# EAGLE schematic display72 (EAGLE 7.7.0)

## Sheet 1 of 5: Powersupply
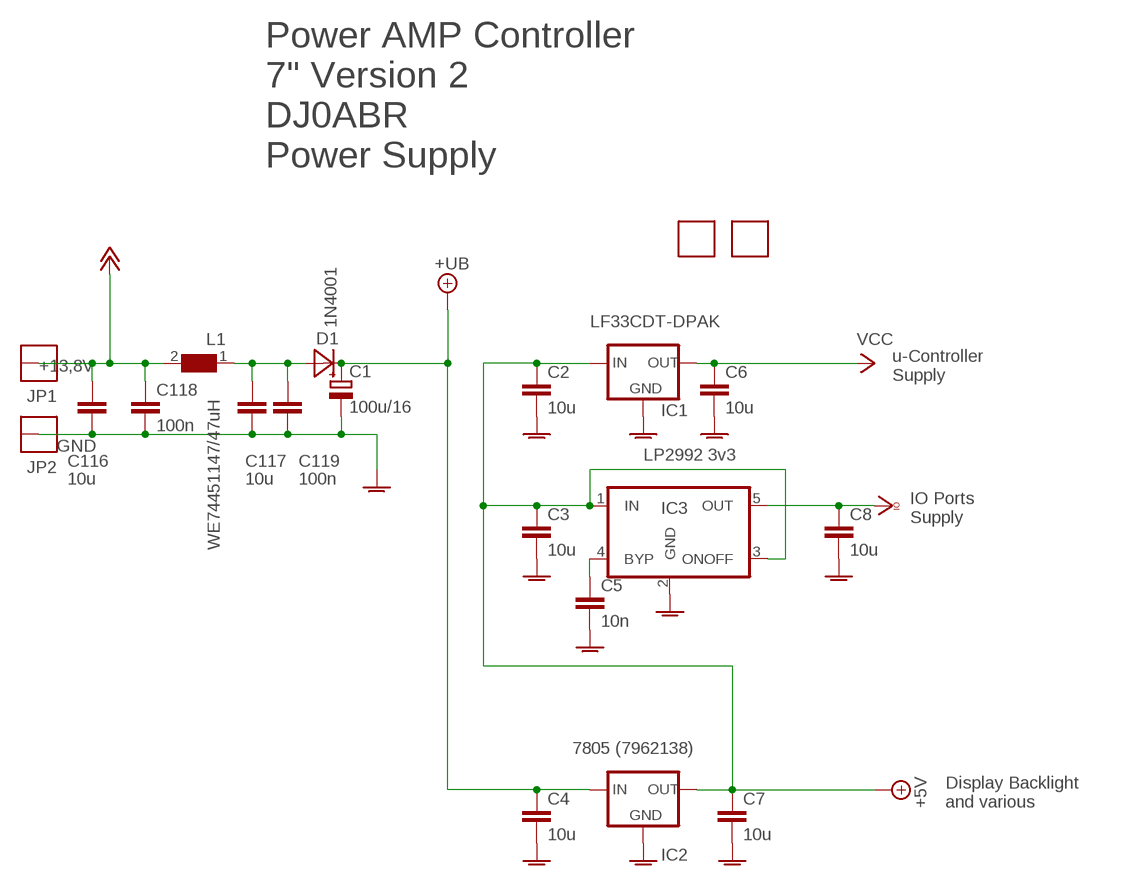
[diagram p0: schematic, sheet 1]

### Parts
C1  100u/16  CPOL-EUE2.5-7  [E2,5-7]
C2  10u  C-EUC0805  [C0805]
C3  10u  C-EUC0805  [C0805]
C4  10u  C-EUC0805  [C0805]
C5  10n  C-EUC0603  [C0603]
C6  10u  C-EUC0603  [C0603]
C7  10u  C-EUC0603  [C0603]
C8  10u  C-EUC0603  [C0603]
C116  10u  C-EUC0805  [C0805]
C117  10u  C-EUC0805  [C0805]
C118  100n  C-EUC0603  [C0603]
C119  100n  C-EUC0603  [C0603]
D1  1N4001  DIODE_GROSSSMD  [MELF]
FID1  FIDUCIAL  [FIDUCIAL]
FID2  FIDUCIAL  [FIDUCIAL]
IC1  LF33CDT-DPAK  LP2950CDT-5.0  [DPACK]
IC2  7805 (7962138)  78XXSWITCHREG  [78SR_SWITCHREG]
IC3  LP2992 3v3  UREG5  [SOT23-5]
JP1  THICKPINSQUARE  [THICKPIN]
JP2  THICKPINSQUARE  [THICKPIN]
L1  WE74451147/47uH  WE-PD3-74451147_S  [S]

### Nets
+5V: C2.1 C3.1 C7.1 IC1.1(IN) IC2.3(OUT) IC3.1(IN) IC3.3(ONOFF) ; also sheet 3,4
+UB [Supply]: C1.+ C4.1 D1.1(C) IC2.1(IN)
AGND [AGND]: C1.- C2.2 C3.2 C4.2 C5.2 C6.2 C7.2 C8.2 C116.2 C117.2 C118.2 C119.2 IC1.4(GND) IC2.2(GND) IC3.2(GND) JP2.1 ; supply symbol labelled  ; also sheet 2,3,4,5
N$47 [Supply]: C117.1 C119.1 D1.2(A) L1.1
N$125: C5.1 IC3.4(BYP)
PLUSZWOELF [Supply]: C116.1 C118.1 JP1.1 L1.2 ; supply symbol labelled +12V ; also sheet 2
VCC [Supply]: C6.1 IC1.3(OUT) ; also sheet 2,4,5
VCCIO [Supply]: C8.1 IC3.5(OUT) ; supply symbol labelled  ; also sheet 3,4
Unconnected: FID1.P$1 FID2.P$1

### Notes on the sheet
- Power AMP Controller
  7" Version 2
  DJ0ABR
  Power Supply
- +13,8V
- u-Controller 
  Supply
- GND
- IO Ports
  Supply
- Display Backlight
  and various

## Sheet 2 of 5: IO Ports LED,PTT,Switch
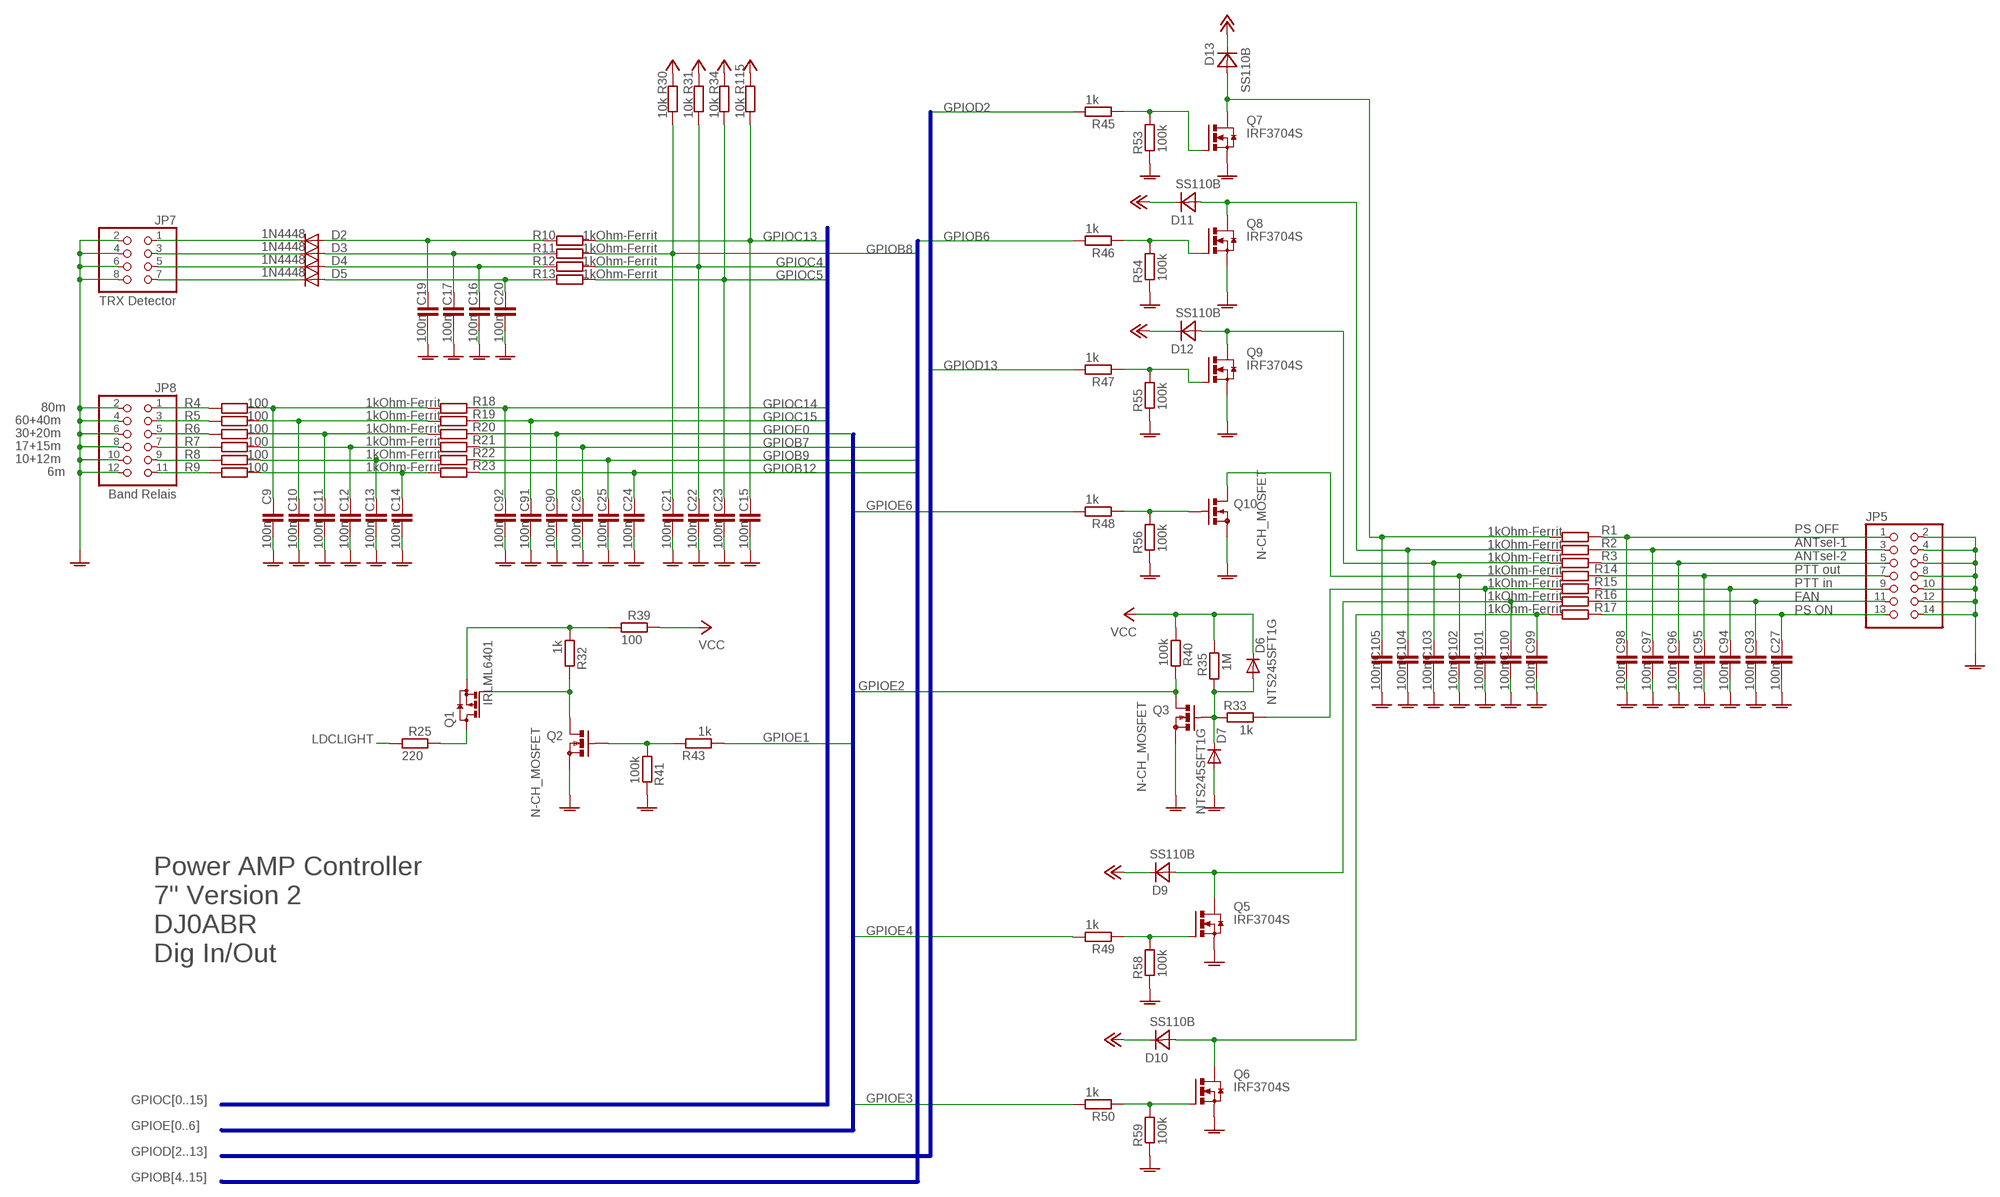
[diagram p1: schematic, sheet 2]

### Parts
C9  100n  C-EUC0603  [C0603]
C10  100n  C-EUC0603  [C0603]
C11  100n  C-EUC0603  [C0603]
C12  100n  C-EUC0603  [C0603]
C13  100n  C-EUC0603  [C0603]
C14  100n  C-EUC0603  [C0603]
C15  100n  C-EUC0603  [C0603]
C16  100n  C-EUC0603  [C0603]
C17  100n  C-EUC0603  [C0603]
C19  100n  C-EUC0603  [C0603]
C20  100n  C-EUC0603  [C0603]
C21  100n  C-EUC0603  [C0603]
C22  100n  C-EUC0603  [C0603]
C23  100n  C-EUC0603  [C0603]
C24  100n  C-EUC0603  [C0603]
C25  100n  C-EUC0603  [C0603]
C26  100n  C-EUC0603  [C0603]
C27  100n  C-EUC0603  [C0603]
C90  100n  C-EUC0603  [C0603]
C91  100n  C-EUC0603  [C0603]
C92  100n  C-EUC0603  [C0603]
C93  100n  C-EUC0603  [C0603]
C94  100n  C-EUC0603  [C0603]
C95  100n  C-EUC0603  [C0603]
C96  100n  C-EUC0603  [C0603]
C97  100n  C-EUC0603  [C0603]
C98  100n  C-EUC0603  [C0603]
C99  100n  C-EUC0603  [C0603]
C100  100n  C-EUC0603  [C0603]
C101  100n  C-EUC0603  [C0603]
C102  100n  C-EUC0603  [C0603]
C103  100n  C-EUC0603  [C0603]
C104  100n  C-EUC0603  [C0603]
C105  100n  C-EUC0603  [C0603]
D2  1N4448  DIODE-SOD523  [SOD523]
D3  1N4448  DIODE-SOD523  [SOD523]
D4  1N4448  DIODE-SOD523  [SOD523]
D5  1N4448  DIODE-SOD523  [SOD523]
D6  NTS245SFT1G  DIODE-MINIMELF  [MINIMELF]
D7  NTS245SFT1G  DIODE-MINIMELF  [MINIMELF]
D9  SS110B  DIODE_GROSSSMD  [MELF]
D10  SS110B  DIODE_GROSSSMD  [MELF]
D11  SS110B  DIODE_GROSSSMD  [MELF]
D12  SS110B  DIODE_GROSSSMD  [MELF]
D13  SS110B  DIODE_GROSSSMD  [MELF]
JP5  PINHD-2X7/90  [2X07/90]
JP7  TRX Detector  PINHD-2X4/90  [2X04/90]
JP8  Band Relais  PINHD-2X6/90  [2X06/90]
Q1  IRLML6401  BSS84  [SOT23]
Q2  N-CH_MOSFET  BS170_SMD  [SOT23]
Q3  N-CH_MOSFET  BS170_SMD  [SOT23]
Q5  IRF3704S  [D2PACK]
Q6  IRF3704S  [D2PACK]
Q7  IRF3704S  [D2PACK]
Q8  IRF3704S  [D2PACK]
Q9  IRF3704S  [D2PACK]
Q10  N-CH_MOSFET  BS170_SMD  [SOT23]
R1  1kOhm-Ferrit  R-EU_R0603  [R0603]
R2  1kOhm-Ferrit  R-EU_R0603  [R0603]
R3  1kOhm-Ferrit  R-EU_R0603  [R0603]
R4  100  R-EU_R0603  [R0603]
R5  100  R-EU_R0603  [R0603]
R6  100  R-EU_R0603  [R0603]
R7  100  R-EU_R0603  [R0603]
R8  100  R-EU_R0603  [R0603]
R9  100  R-EU_R0603  [R0603]
R10  1kOhm-Ferrit  R-EU_R0603  [R0603]
R11  1kOhm-Ferrit  R-EU_R0603  [R0603]
R12  1kOhm-Ferrit  R-EU_R0603  [R0603]
R13  1kOhm-Ferrit  R-EU_R0603  [R0603]
R14  1kOhm-Ferrit  R-EU_R0603  [R0603]
R15  1kOhm-Ferrit  R-EU_R0603  [R0603]
R16  1kOhm-Ferrit  R-EU_R0603  [R0603]
R17  1kOhm-Ferrit  R-EU_R0603  [R0603]
R18  1kOhm-Ferrit  R-EU_R0603  [R0603]
R19  1kOhm-Ferrit  R-EU_R0603  [R0603]
R20  1kOhm-Ferrit  R-EU_R0603  [R0603]
R21  1kOhm-Ferrit  R-EU_R0603  [R0603]
R22  1kOhm-Ferrit  R-EU_R0603  [R0603]
R23  1kOhm-Ferrit  R-EU_R0603  [R0603]
R25  220  R-EU_R0603  [R0603]
R30  10k  R-EU_R0603  [R0603]
R31  10k  R-EU_R0603  [R0603]
R32  1k  R-EU_R0603  [R0603]
R33  1k  R-EU_R0603  [R0603]
R34  10k  R-EU_R0603  [R0603]
R35  1M  R-EU_R0603  [R0603]
R39  100  R-EU_R0603  [R0603]
R40  100k  R-EU_R0603  [R0603]
R41  100k  R-EU_R0603  [R0603]
R43  1k  R-EU_R0603  [R0603]
R45  1k  R-EU_R0603  [R0603]
R46  1k  R-EU_R0603  [R0603]
R47  1k  R-EU_R0603  [R0603]
R48  1k  R-EU_R0603  [R0603]
R49  1k  R-EU_R0603  [R0603]
R50  1k  R-EU_R0603  [R0603]
R53  100k  R-EU_R0603  [R0603]
R54  100k  R-EU_R0603  [R0603]
R55  100k  R-EU_R0603  [R0603]
R56  100k  R-EU_R0603  [R0603]
R58  100k  R-EU_R0603  [R0603]
R59  100k  R-EU_R0603  [R0603]
R115  10k  R-EU_R0603  [R0603]

### Nets
AGND [AGND]: C9.2 C10.2 C11.2 C12.2 C13.2 C14.2 C15.2 C16.2 C17.2 C19.2 C20.2 C21.2 C22.2 C23.2 C24.2 C25.2 C26.2 C27.2 C90.2 C91.2 C92.2 C93.2 C94.2 C95.2 C96.2 C97.2 C98.2 C99.2 C100.2 C101.2 C102.2 C103.2 C104.2 C105.2 D7.A JP5.2 JP5.4 JP5.6 JP5.8 JP5.10 JP5.12 JP5.14 JP7.2 JP7.4 JP7.6 JP7.8 JP8.2 JP8.4 JP8.6 JP8.8 JP8.10 JP8.12 Q2.2(S) Q3.2(S) Q5.3(S) Q6.3(S) Q7.3(S) Q8.3(S) Q9.3(S) Q10.2(S) R41.2 R53.2 R54.2 R55.2 R56.2 R58.2 R59.2 ; supply symbol labelled  ; also sheet 1,3,4,5
GPIOB6: R46.1 ; also sheet 4
GPIOB7: C26.1 R21.1 ; also sheet 4
GPIOB8: C21.1 R11.2 R30.1 ; also sheet 4
GPIOB9: C25.1 R22.1 ; also sheet 4
GPIOB12: C24.1 R23.1 ; also sheet 4
GPIOC4: C22.1 R12.2 R31.1 ; also sheet 4
GPIOC5: C23.1 R13.2 R34.1 ; also sheet 4
GPIOC13: C15.1 R10.2 R115.1 ; also sheet 4
GPIOC14: C92.1 R18.1 ; also sheet 4
GPIOC15: C91.1 R19.1 ; also sheet 4
GPIOD2: R45.1 ; also sheet 4
GPIOD13: R47.1 ; also sheet 4
GPIOE0: C90.1 R20.1 ; also sheet 4
GPIOE1: R43.1 ; also sheet 4
GPIOE2: Q3.3(D) R40.1 ; also sheet 4
GPIOE3: R50.1 ; also sheet 4
GPIOE4: R49.1 ; also sheet 4
GPIOE6: R48.1 ; also sheet 4
LDCLIGHT: R25.1 ; also sheet 4
N$1: Q10.1(G) R48.2 R56.1
N$2: C102.1 Q10.3(D) R14.2
N$4: D6.A D7.C Q3.1(G) R33.2 R35.2
N$6: Q2.1(G) R41.1 R43.2
N$8: Q1.1(G) Q2.3(D) R32.2
N$10: Q1.3(D) R25.2
N$12: JP8.1 R4.1
N$33: C98.1 JP5.1 R1.1
N$45: Q9.1(G) R47.2 R55.1
N$46: C103.1 D12.2(A) Q9.2(D) R3.2
N$50: C97.1 JP5.3 R2.1
N$51: C96.1 JP5.5 R3.1
N$52: C95.1 JP5.7 R14.1
N$56: C94.1 JP5.9 R15.1
N$57: C93.1 JP5.11 R16.1
N$58: D3.C JP7.3
N$59: D4.C JP7.5
N$60: D5.C JP7.7
N$63: C27.1 JP5.13 R17.1
N$90: C9.1 R4.2 R18.2
N$94: C14.1 R9.2 R23.2
N$95: C13.1 R8.2 R22.2
N$98: C12.1 R7.2 R21.2
N$99: C11.1 R6.2 R20.2
N$100: C10.1 R5.2 R19.2
N$105: Q1.2(S) R32.1 R39.1
N$106: D2.C JP7.1
N$109: Q8.1(G) R46.2 R54.1
N$110: C104.1 D11.2(A) Q8.2(D) R2.2
N$115: JP8.3 R5.1
N$116: JP8.5 R6.1
N$118: Q7.1(G) R45.2 R53.1
N$119: JP8.7 R7.1
N$120: JP8.9 R8.1
N$121: JP8.11 R9.1
N$122: C105.1 D13.2(A) Q7.2(D) R1.2
N$126: C19.1 D2.A R10.1
N$127: C17.1 D3.A R11.1
N$128: C16.1 D4.A R12.1
N$129: C20.1 D5.A R13.1
N$132: C100.1 D9.2(A) Q5.2(D) R16.2
N$134: Q5.1(G) R49.2 R58.1
N$135: C99.1 D10.2(A) Q6.2(D) R17.2
N$136: Q6.1(G) R50.2 R59.1
PLUSZWOELF [Supply]: D9.1(C) D10.1(C) D11.1(C) D12.1(C) D13.1(C) ; supply symbol labelled +12V ; also sheet 1
PTT: C101.1 R15.2 R33.1
VCC [Supply]: D6.C R30.2 R31.2 R34.2 R35.1 R39.2 R40.2 R115.2 ; also sheet 1,4,5

### Buses
GPIOC[0..15]
GPIOE[0..6]
GPIOD[2..13]
GPIOB[4..15]

### Notes on the sheet
- 80m
- 60+40m
- 30+20m
- 17+15m
- 10+12m
- 6m
- PS OFF
  ANTsel-1
  ANTsel-2
  PTT out
  PTT in
  FAN
  PS ON
- Power AMP Controller
  7" Version 2
  DJ0ABR
  Dig In/Out

## Sheet 3 of 5: ANALOG
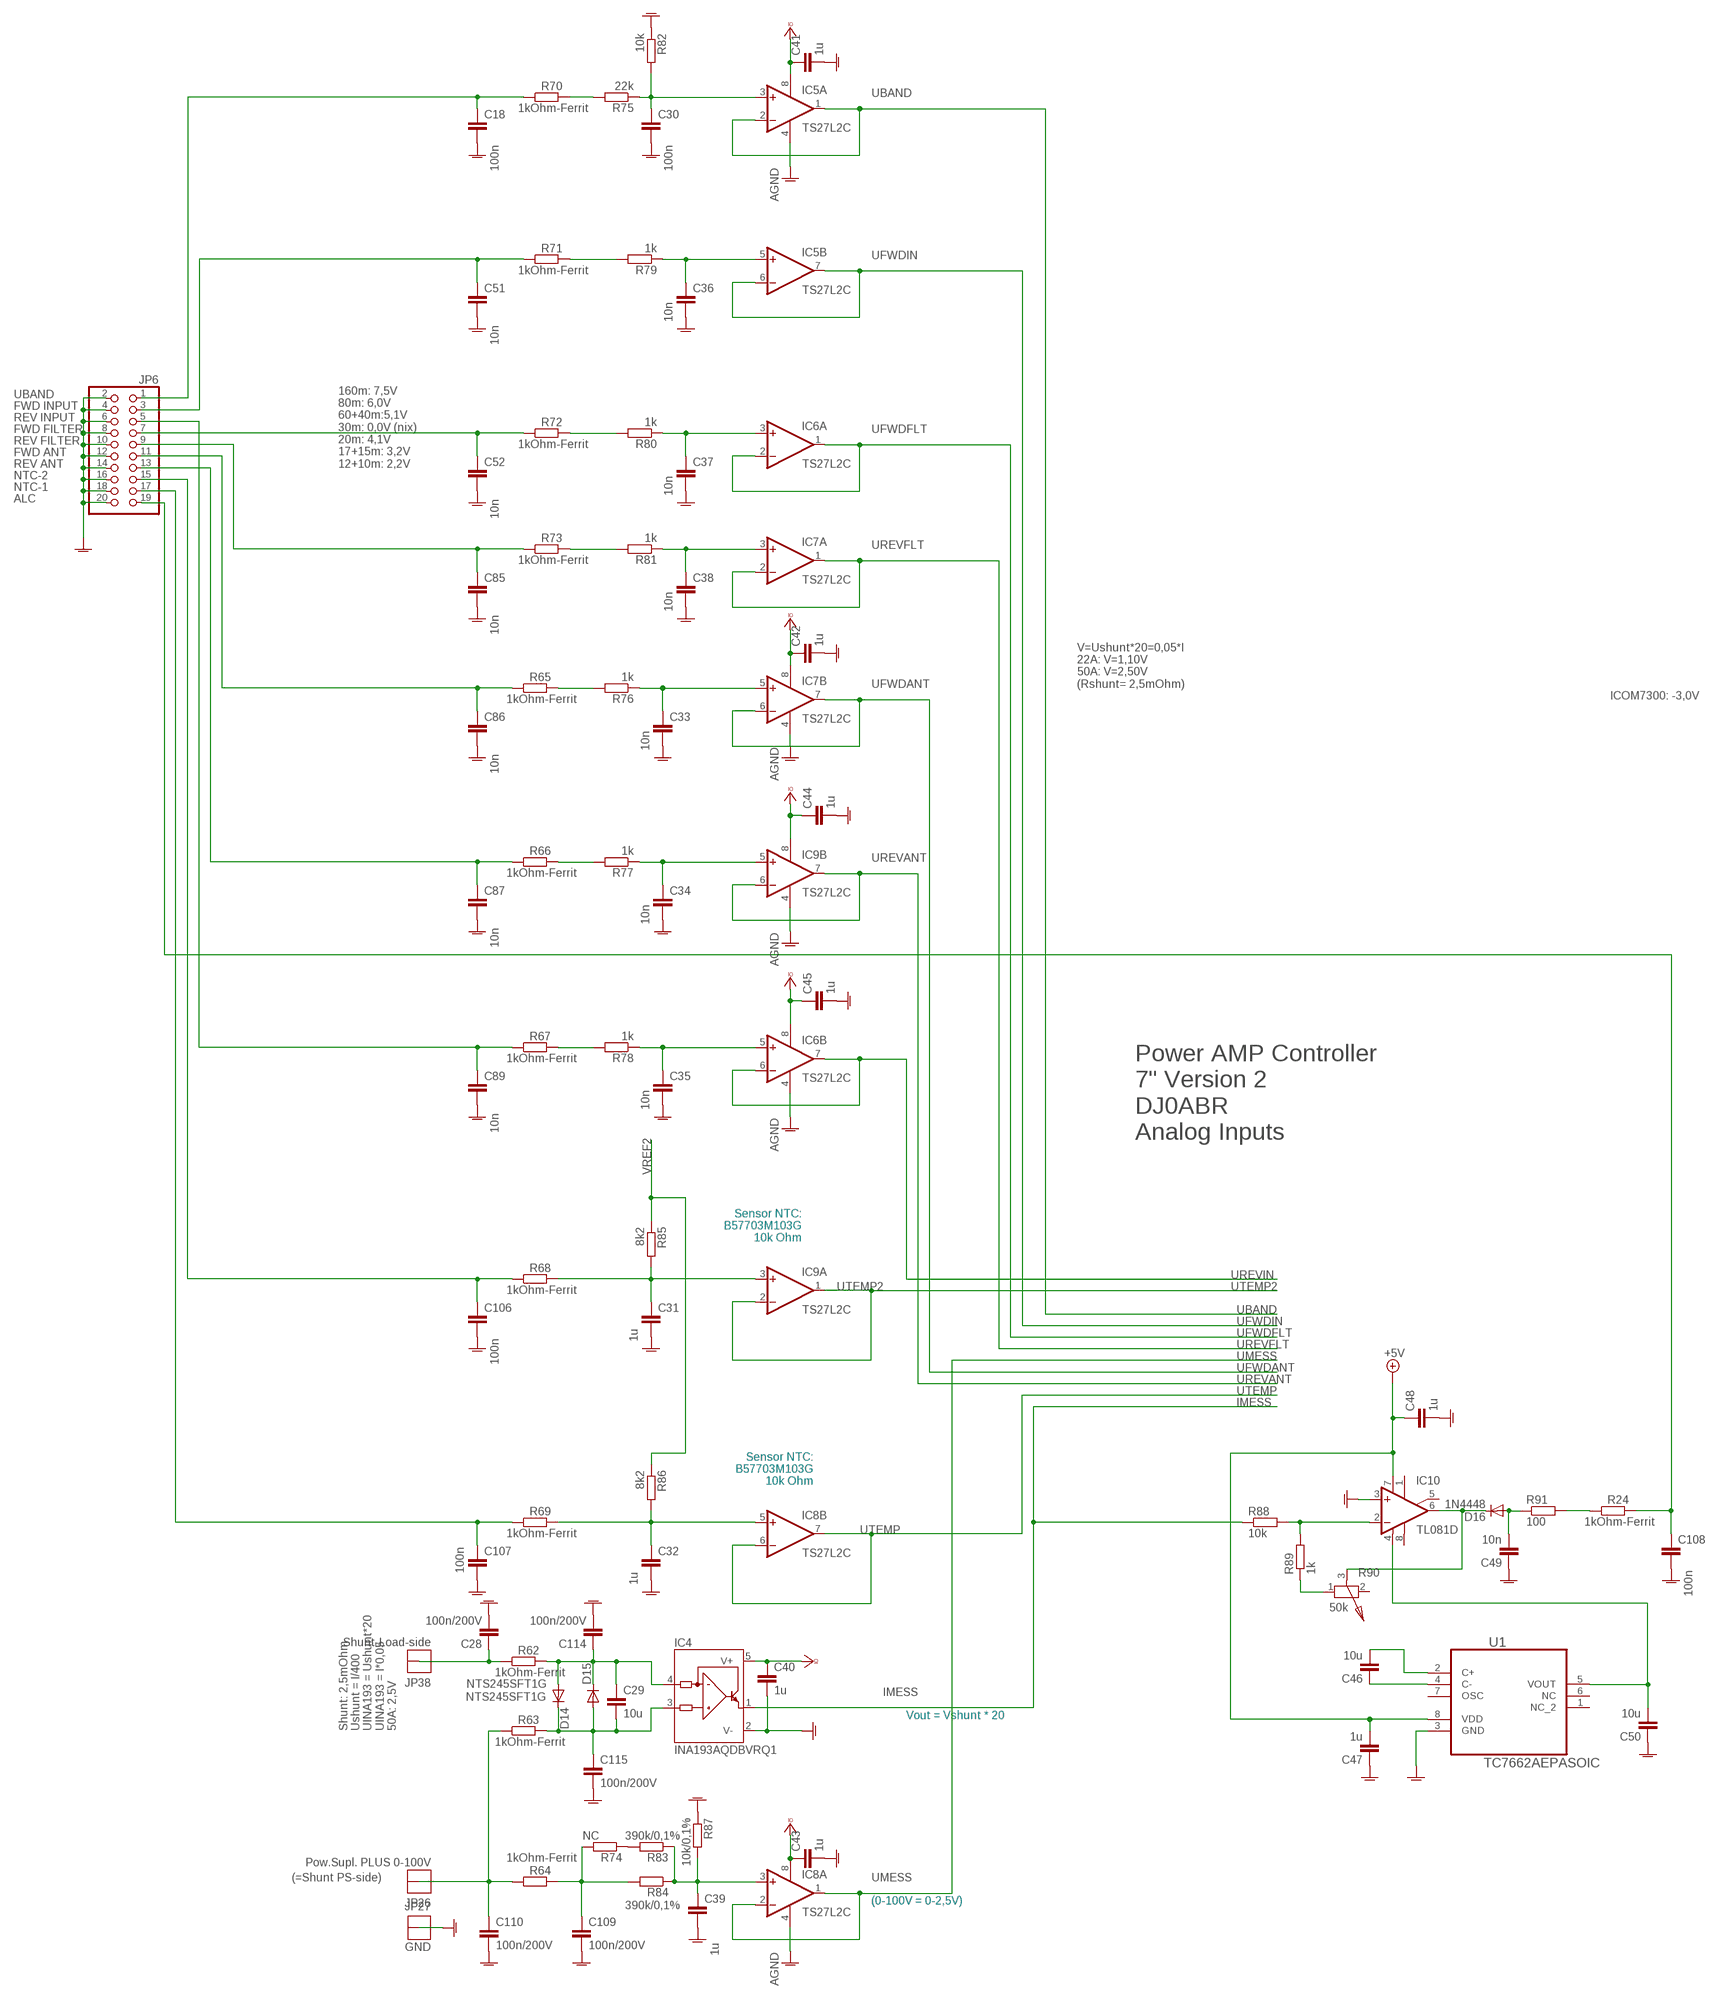
[diagram p2: schematic, sheet 3]

### Parts
C18  100n  C-EUC0603  [C0603]
C28  100n/200V  C-EUC1206K  [C1206K]
C29  10u  C-EUC0805  [C0805]
C30  100n  C-EUC0603  [C0603]
C31  1u  C-EUC0603  [C0603]
C32  1u  C-EUC0603  [C0603]
C33  10n  C-EUC0603  [C0603]
C34  10n  C-EUC0603  [C0603]
C35  10n  C-EUC0603  [C0603]
C36  10n  C-EUC0603  [C0603]
C37  10n  C-EUC0603  [C0603]
C38  10n  C-EUC0603  [C0603]
C39  1u  C-EUC0603  [C0603]
C40  1u  C-EUC0603  [C0603]
C41  1u  C-EUC0603  [C0603]
C42  1u  C-EUC0603  [C0603]
C43  1u  C-EUC0603  [C0603]
C44  1u  C-EUC0603  [C0603]
C45  1u  C-EUC0603  [C0603]
C46  10u  C-EUC0603  [C0603]
C47  1u  C-EUC0603  [C0603]
C48  1u  C-EUC0603  [C0603]
C49  10n  C-EUC0603  [C0603]
C50  10u  C-EUC0603  [C0603]
C51  10n  C-EUC0603  [C0603]
C52  10n  C-EUC0603  [C0603]
C85  10n  C-EUC0603  [C0603]
C86  10n  C-EUC0603  [C0603]
C87  10n  C-EUC0603  [C0603]
C89  10n  C-EUC0603  [C0603]
C106  100n  C-EUC0603  [C0603]
C107  100n  C-EUC0603  [C0603]
C108  100n  C-EUC0603  [C0603]
C109  100n/200V  C-EUC1206K  [C1206K]
C110  100n/200V  C-EUC1206K  [C1206K]
C114  100n/200V  C-EUC1206K  [C1206K]
C115  100n/200V  C-EUC1206K  [C1206K]
D14  NTS245SFT1G  DIODE-MINIMELF  [MINIMELF]
D15  NTS245SFT1G  DIODE-MINIMELF  [MINIMELF]
D16  1N4448  DIODE-SOD523  [SOD523]
IC4  INA193AQDBVRQ1  INA168  [SOT23-5]
IC5  TS27L2C  LM358D  [SO08]
IC6  TS27L2C  LM358D  [SO08]
IC7  TS27L2C  LM358D  [SO08]
IC8  TS27L2C  LM358D  [SO08]
IC9  TS27L2C  LM358D  [SO08]
IC10  TL081D  [SO08]
JP6  PINHD-2X10/90  [2X10/90]
JP26  Pow.Supl. PLUS 0-100V  THICKPINSQUARE  [THICKPIN]
JP27  GND  THICKPINSQUARE  [THICKPIN]
JP38  Shunt-Load-side  THICKPINSQUARE  [THICKPIN]
R24  1kOhm-Ferrit  R-EU_R0603  [R0603]
R62  1kOhm-Ferrit  R-EU_R0603  [R0603]
R63  1kOhm-Ferrit  R-EU_R0603  [R0603]
R64  1kOhm-Ferrit  R-EU_R0603  [R0603]
R65  1kOhm-Ferrit  R-EU_R0603  [R0603]
R66  1kOhm-Ferrit  R-EU_R0603  [R0603]
R67  1kOhm-Ferrit  R-EU_R0603  [R0603]
R68  1kOhm-Ferrit  R-EU_R0603  [R0603]
R69  1kOhm-Ferrit  R-EU_R0603  [R0603]
R70  1kOhm-Ferrit  R-EU_R0603  [R0603]
R71  1kOhm-Ferrit  R-EU_R0603  [R0603]
R72  1kOhm-Ferrit  R-EU_R0603  [R0603]
R73  1kOhm-Ferrit  R-EU_R0603  [R0603]
R74  NC  R-EU_R0603  [R0603]
R75  22k  R-EU_R0603  [R0603]
R76  1k  R-EU_R0603  [R0603]
R77  1k  R-EU_R0603  [R0603]
R78  1k  R-EU_R0603  [R0603]
R79  1k  R-EU_R0603  [R0603]
R80  1k  R-EU_R0603  [R0603]
R81  1k  R-EU_R0603  [R0603]
R82  10k  R-EU_R0603  [R0603]
R83  390k/0,1%  R-EU_R0603  [R0603]
R84  390k/0,1%  R-EU_R0603  [R0603]
R85  8k2  R-EU_R0603  [R0603]
R86  8k2  R-EU_R0603  [R0603]
R87  10k/0,1%  R-EU_R0603  [R0603]
R88  10k  R-EU_R0603  [R0603]
R89  1k  R-EU_R0603  [R0603]
R90  50k  MINIPOTI-S  [MINIPOTI]
R91  100  R-EU_R0603  [R0603]
U1  TC7662AEPASOIC  [SO-8]

### Nets
+5V: C47.2 C48.1 IC10.7(V+) U1.8(VDD) ; also sheet 1,4
AGND [AGND]: C18.2 C28.2 C30.2 C31.2 C32.2 C33.2 C34.2 C35.2 C36.2 C37.2 C38.2 C39.2 C40.2 C41.2 C42.2 C43.2 C44.2 C45.2 C47.1 C48.2 C49.1 C50.1 C51.2 C52.2 C85.2 C86.2 C87.2 C89.2 C106.2 C107.2 C108.2 C109.2 C110.2 C114.2 C115.2 IC4.2(V-) IC5.4(P:V-) IC6.4(P:V-) IC7.4(P:V-) IC8.4(P:V-) IC9.4(P:V-) IC10.3(+IN) JP6.2 JP6.4 JP6.6 JP6.8 JP6.10 JP6.12 JP6.14 JP6.16 JP6.18 JP6.20 JP27.1 R82.1 R87.1 U1.3(GND) ; supply symbol labelled  ; also sheet 1,2,4,5
IMESS: IC4.1(OUT) R88.1 ; also sheet 4
N$3: R24.1 R91.2
N$19: R70.2 R75.2
N$21: R71.2 R79.2
N$38: R72.2 R80.2
N$49: C30.1 IC5.3(A:+IN) R75.1 R82.2
N$53: C18.1 JP6.1 R70.1
N$54: R73.2 R81.2
N$55: C109.1 R64.2 R74.2 R84.2
N$61: R65.2 R76.2
N$62: R66.2 R77.2
N$64: C39.1 IC8.3(A:+IN) R83.1 R84.1 R87.2
N$72: C33.1 IC7.5(B:+IN) R76.1
N$73: C86.1 JP6.11 R65.1
N$75: C34.1 IC9.5(B:+IN) R77.1
N$76: C87.1 JP6.13 R66.1
N$78: C29.1 C114.1 D14.A D15.C IC4.4(IN-) R62.2
N$79: C29.2 C115.1 D14.C D15.A IC4.3(IN+) R63.2
N$80: C28.1 JP38.1 R62.1
N$81: C110.1 JP26.1 R63.1 R64.1
N$82: C32.1 IC8.5(B:+IN) R69.2 R86.2
N$83: C107.1 JP6.17 R69.1
N$85: C38.1 IC7.3(A:+IN) R81.1
N$86: C85.1 JP6.9 R73.1
N$88: C37.1 IC6.3(A:+IN) R80.1
N$89: C52.1 JP6.7 R72.1
N$91: C36.1 IC5.5(B:+IN) R79.1
N$92: C51.1 JP6.3 R71.1
N$108: C35.1 IC6.5(B:+IN) R78.1
N$111: C89.1 JP6.5 R67.1
N$112: R67.2 R78.2
N$113: C31.1 IC9.3(A:+IN) R68.2 R85.2
N$114: C106.1 JP6.15 R68.1
N$124: R74.1 R83.2
N$144: C46.1 U1.4(C-)
N$145: C46.2 U1.2(C+)
N$146: C50.2 IC10.4(V-) U1.5(VOUT)
N$147: D16.C IC10.6(OUT) R90.3
N$148: C108.1 JP6.19 R24.2
N$149: IC10.2(-IN) R88.2 R89.2
N$150: R89.1 R90.1
N$151: C49.2 D16.A R91.1
UBAND: IC5.1(A:OUT) IC5.2(A:-IN) ; also sheet 4
UFWDANT: IC7.6(B:-IN) IC7.7(B:OUT) ; also sheet 4
UFWDFLT: IC6.1(A:OUT) IC6.2(A:-IN) ; also sheet 4
UFWDIN: IC5.6(B:-IN) IC5.7(B:OUT) ; also sheet 4
UMESS: IC8.1(A:OUT) IC8.2(A:-IN) ; also sheet 4
UREVANT: IC9.6(B:-IN) IC9.7(B:OUT) ; also sheet 4
UREVFLT: IC7.1(A:OUT) IC7.2(A:-IN) ; also sheet 4
UREVIN: IC6.6(B:-IN) IC6.7(B:OUT) ; also sheet 4
UTEMP: IC8.6(B:-IN) IC8.7(B:OUT) ; also sheet 4
UTEMP2: IC9.1(A:OUT) IC9.2(A:-IN) ; also sheet 4
VCCIO [Supply]: C40.1 C41.1 C42.1 C43.1 C44.1 C45.1 IC4.5(V+) IC5.8(P:V+) IC6.8(P:V+) IC7.8(P:V+) IC8.8(P:V+) IC9.8(P:V+) ; supply symbol labelled  ; also sheet 1,4
VREF2: R85.1 R86.1 ; also sheet 4
Unconnected: IC10.1(ON1) IC10.5(ON2) IC10.8(OPT) R90.2 U1.1(NC_2) U1.6(NC) U1.7(OSC)

### Notes on the sheet
- UBAND
- FWD INPUT
- REV INPUT
- FWD FILTER
- REV FILTER
- FWD ANT
- REV ANT
- 160m: 7,5V
  80m: 6,0V
  60+40m:5,1V
  30m: 0,0V (nix)
  20m: 4,1V
  17+15m: 3,2V
  12+10m: 2,2V
- NTC-2
- NTC-1
- ALC
- V=Ushunt*20=0,05*I
  22A: V=1,10V
  50A: V=2,50V
  (Rshunt= 2,5mOhm)
- ICOM7300: -3,0V
- Power AMP Controller
  7" Version 2
  DJ0ABR
  Analog Inputs
- Sensor NTC:
  B57703M103G
  10k Ohm
- Sensor NTC:
  B57703M103G
  10k Ohm
- Vout = Vshunt * 20
- Shunt: 2,5mOhm
  Ushunt = I/400
  UINA193 = Ushunt*20
  UINA193 = I*0,05
  50A: 2,5V
- (=Shunt PS-side)
- (0-100V = 0-2,5V)

## Sheet 4 of 5: CPU
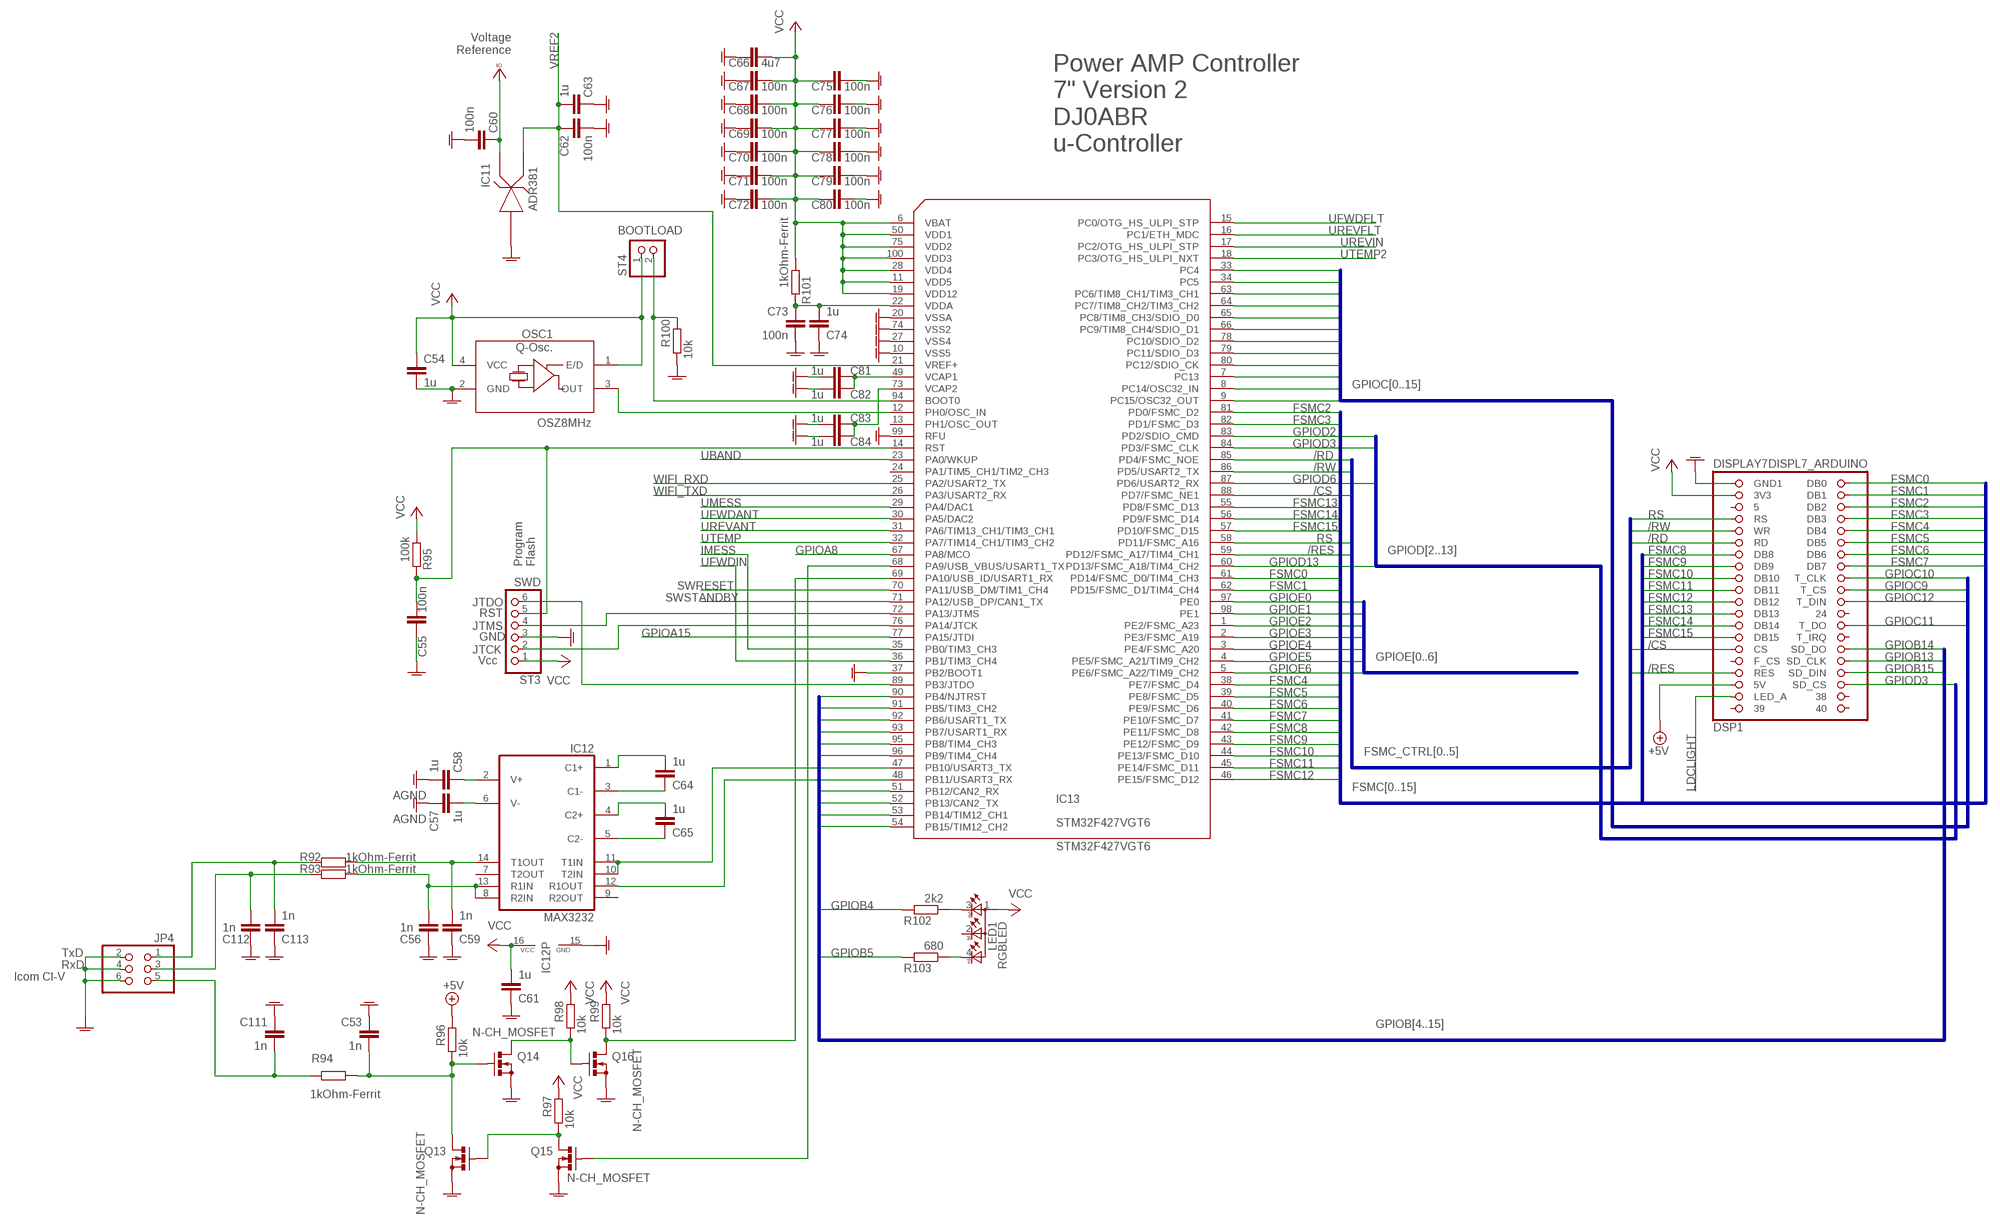
[diagram p3: schematic, sheet 4]

### Parts
C53  1n  C-EUC0603  [C0603]
C54  1u  C-EUC0603K  [C0603K]
C55  100n  C-EUC0603  [C0603]
C56  1n  C-EUC0603  [C0603]
C57  1u  C-EUC0603K  [C0603K]
C58  1u  C-EUC0603K  [C0603K]
C59  1n  C-EUC0603  [C0603]
C60  100n  C-EUC0603  [C0603]
C61  1u  C-EUC0603  [C0603]
C62  100n  C-EUC0603  [C0603]
C63  1u  C-EUC0603  [C0603]
C64  1u  C-EUC0603K  [C0603K]
C65  1u  C-EUC0603K  [C0603K]
C66  4u7  C-EUC0603  [C0603]
C67  100n  C-EUC0603  [C0603]
C68  100n  C-EUC0603  [C0603]
C69  100n  C-EUC0603  [C0603]
C70  100n  C-EUC0603  [C0603]
C71  100n  C-EUC0603  [C0603]
C72  100n  C-EUC0603  [C0603]
C73  100n  C-EUC0603  [C0603]
C74  1u  C-EUC0603  [C0603]
C75  100n  C-EUC0603  [C0603]
C76  100n  C-EUC0603  [C0603]
C77  100n  C-EUC0603  [C0603]
C78  100n  C-EUC0603  [C0603]
C79  100n  C-EUC0603  [C0603]
C80  100n  C-EUC0603  [C0603]
C81  1u  C-EUC0603K  [C0603K]
C82  1u  C-EUC0603K  [C0603K]
C83  1u  C-EUC0603K  [C0603K]
C84  1u  C-EUC0603K  [C0603K]
C111  1n  C-EUC0603  [C0603]
C112  1n  C-EUC0603  [C0603]
C113  1n  C-EUC0603  [C0603]
DSP1  DISPLAY7DISPL7_ARDUINO  [2X20]
IC11  ADR381  LT1004  [SOT23]
IC12  MAX3232  MAX3232CSE  [SO16]
IC13  STM32F427VGT6  STM32F205VG  [TQFP100]
JP4  PINHD-2X3/90  [2X03/90]
LED1  RGBLED  LED_RGB_WE  [PLCC4_WE_LED]
OSC1  OSZ8MHz  QOSC_AURELAURIS7050  [QOSC_AQO7015]
Q13  N-CH_MOSFET  BS170_SMD  [SOT23]
Q14  N-CH_MOSFET  BS170_SMD  [SOT23]
Q15  N-CH_MOSFET  BS170_SMD  [SOT23]
Q16  N-CH_MOSFET  BS170_SMD  [SOT23]
R92  1kOhm-Ferrit  R-EU_R0603  [R0603]
R93  1kOhm-Ferrit  R-EU_R0603  [R0603]
R94  1kOhm-Ferrit  R-EU_R0603  [R0603]
R95  100k  R-EU_R0603  [R0603]
R96  10k  R-EU_R0603  [R0603]
R97  10k  R-EU_R0603  [R0603]
R98  10k  R-EU_R0603  [R0603]
R99  10k  R-EU_R0603  [R0603]
R100  10k  R-EU_R0603  [R0603]
R101  1kOhm-Ferrit  R-EU_R0603  [R0603]
R102  2k2  R-EU_R0603  [R0603]
R103  680  R-EU_R0603  [R0603]
ST3  SWD  PINHEAD6X1P6  [PINHEAD6X1]
ST4  PINHEAD2X1SMALL  [PINHEAD1X2]

### Nets
+5V: DSP1.35(5V) R96.2 ; also sheet 1,3
/CS: DSP1.29(CS) IC13.88(PD7/FSMC_NE1)
/RD: DSP1.11(RD) IC13.85(PD4/FSMC_NOE)
/RES: DSP1.33(RES) IC13.59(PD12/FSMC_A17/TIM4_CH1)
/RW: DSP1.9(WR) IC13.86(PD5/USART2_TX)
AGND [AGND]: C53.1 C54.2 C55.1 C56.1 C57.1 C58.2 C59.1 C60.2 C61.1 C62.2 C63.1 C66.1 C67.1 C68.1 C69.1 C70.1 C71.1 C72.1 C73.2 C74.1 C75.2 C76.2 C77.2 C78.2 C79.2 C80.2 C81.1 C82.1 C83.1 C84.1 C111.1 C112.1 C113.1 DSP1.1(GND1) IC11.3(A) IC12.15(GND) IC13.10(VSS5) IC13.20(VSSA) IC13.27(VSS4) IC13.37(PB2/BOOT1) IC13.74(VSS2) IC13.99(RFU) JP4.2 JP4.4 JP4.6 OSC1.2(GND) Q13.2(S) Q14.2(S) Q15.2(S) Q16.2(S) R100.1 ST3.3 ; supply symbol labelled  ; also sheet 1,2,3,5
FSMC0: DSP1.2(DB0) IC13.61(PD14/FSMC_D0/TIM4_CH3)
FSMC1: DSP1.4(DB1) IC13.62(PD15/FSMC_D1/TIM4_CH4)
FSMC2: DSP1.6(DB2) IC13.81(PD0/FSMC_D2)
FSMC3: DSP1.8(DB3) IC13.82(PD1/FSMC_D3)
FSMC4: DSP1.10(DB4) IC13.38(PE7/FSMC_D4)
FSMC5: DSP1.12(DB5) IC13.39(PE8/FSMC_D5)
FSMC6: DSP1.14(DB6) IC13.40(PE9/FSMC_D6)
FSMC7: DSP1.16(DB7) IC13.41(PE10/FSMC_D7)
FSMC8: DSP1.13(DB8) IC13.42(PE11/FSMC_D8)
FSMC9: DSP1.15(DB9) IC13.43(PE12/FSMC_D9)
FSMC10: DSP1.17(DB10) IC13.44(PE13/FSMC_D10)
FSMC11: DSP1.19(DB11) IC13.45(PE14/FSMC_D11)
FSMC12: DSP1.21(DB12) IC13.46(PE15/FSMC_D12)
FSMC13: DSP1.23(DB13) IC13.55(PD8/FSMC_D13)
FSMC14: DSP1.25(DB14) IC13.56(PD9/FSMC_D14)
FSMC15: DSP1.27(DB15) IC13.57(PD10/FSMC_D15)
GPIOA8: IC13.67(PA8/MCO)
GPIOA15: IC13.77(PA15/JTDI)
GPIOB4: IC13.90(PB4/NJTRST) R102.2
GPIOB5: IC13.91(PB5/TIM3_CH2) R103.2
GPIOB6: IC13.92(PB6/USART1_TX) ; also sheet 2
GPIOB7: IC13.93(PB7/USART1_RX) ; also sheet 2
GPIOB8: IC13.95(PB8/TIM4_CH3) ; also sheet 2
GPIOB9: IC13.96(PB9/TIM4_CH4) ; also sheet 2
GPIOB12: IC13.51(PB12/CAN2_RX) ; also sheet 2
GPIOB13: DSP1.32(SD_CLK) IC13.52(PB13/CAN2_TX)
GPIOB14: DSP1.30(SD_DO) IC13.53(PB14/TIM12_CH1)
GPIOB15: DSP1.34(SD_DIN) IC13.54(PB15/TIM12_CH2)
GPIOC4: IC13.33(PC4) ; also sheet 2
GPIOC5: IC13.34(PC5) ; also sheet 2
GPIOC6: IC13.63(PC6/TIM8_CH1/TIM3_CH1)
GPIOC7: IC13.64(PC7/TIM8_CH2/TIM3_CH2)
GPIOC8: IC13.65(PC8/TIM8_CH3/SDIO_D0)
GPIOC9: DSP1.20(T_CS) IC13.66(PC9/TIM8_CH4/SDIO_D1)
GPIOC10: DSP1.18(T_CLK) IC13.78(PC10/SDIO_D2)
GPIOC11: DSP1.26(T_DO) IC13.79(PC11/SDIO_D3)
GPIOC12: DSP1.22(T_DIN) IC13.80(PC12/SDIO_CK)
GPIOC13: IC13.7(PC13) ; also sheet 2
GPIOC14: IC13.8(PC14/OSC32_IN) ; also sheet 2
GPIOC15: IC13.9(PC15/OSC32_OUT) ; also sheet 2
GPIOD2: IC13.83(PD2/SDIO_CMD) ; also sheet 2
GPIOD3: DSP1.36(SD_CS) IC13.84(PD3/FSMC_CLK)
GPIOD6: IC13.87(PD6/USART2_RX)
GPIOD13: IC13.60(PD13/FSMC_A18/TIM4_CH2) ; also sheet 2
GPIOE0: IC13.97(PE0) ; also sheet 2
GPIOE1: IC13.98(PE1) ; also sheet 2
GPIOE2: IC13.1(PE2/FSMC_A23) ; also sheet 2
GPIOE3: IC13.2(PE3/FSMC_A19) ; also sheet 2
GPIOE4: IC13.3(PE4/FSMC_A20) ; also sheet 2
GPIOE5: IC13.4(PE5/FSMC_A21/TIM9_CH2)
GPIOE6: IC13.5(PE6/FSMC_A22/TIM9_CH2) ; also sheet 2
IMESS: IC13.35(PB0/TIM3_CH3) ; also sheet 3
LDCLIGHT: DSP1.37(LED_A) ; also sheet 2
N$9: LED1.3(CRED) R102.1
N$13: C64.1 IC12.3(C1-)
N$15: C64.2 IC12.1(C1+)
N$28: C65.2 IC12.4(C2+)
N$30: C65.1 IC12.5(C2-)
N$31: C58.1 IC12.2(V+)
N$32: C57.2 IC12.6(V-)
N$34: IC12.10(T2IN) IC12.11(T1IN) IC13.47(PB10/USART3_TX)
N$35: C59.2 IC12.14(T1OUT) R92.2
N$36: C53.2 Q13.3(D) Q14.1(G) R94.2 R96.1
N$37: IC12.12(R1OUT) IC13.48(PB11/USART3_RX)
N$39: Q14.3(D) Q16.1(G) R98.1
N$40: IC13.69(PA10/USB_ID/USART1_RX) Q16.3(D) R99.1
N$41: C56.2 IC12.8(R2IN) IC12.13(R1IN) R93.2
N$42: IC13.68(PA9/USB_VBUS/USART1_TX) Q15.1(G)
N$43: Q13.1(G) Q15.3(D) R97.1
N$48: LED1.4(CGREEN) R103.1
N$77: C113.2 JP4.1 R92.1
N$84: C112.2 JP4.3 R93.1
N$87: C111.2 JP4.5 R94.1
N$117: C83.2 C84.2 IC13.73(VCAP2)
N$153: IC13.12(PH0/OSC_IN) OSC1.3(OUT)
N$154: C81.2 C82.2 IC13.49(VCAP1)
N$156: C73.1 C74.2 IC13.22(VDDA) R101.2
N$157: C55.2 IC13.14(RST) R95.2 ST3.5
N$158: IC13.94(BOOT0) R100.2 ST4.2
N$159: IC13.76(PA14/JTCK) ST3.2
N$160: IC13.72(PA13/JTMS) ST3.4
N$161: IC13.89(PB3/JTDO) ST3.6
RS: DSP1.7(RS) IC13.58(PD11/FSMC_A16)
SWRESET: IC13.70(PA11/USB_DM/TIM1_CH4)
SWSTANDBY: IC13.71(PA12/USB_DP/CAN1_TX)
UBAND: IC13.23(PA0/WKUP) ; also sheet 3
UFWDANT: IC13.30(PA5/DAC2) ; also sheet 3
UFWDFLT: IC13.15(PC0/OTG_HS_ULPI_STP) ; also sheet 3
UFWDIN: IC13.36(PB1/TIM3_CH4) ; also sheet 3
UMESS: IC13.29(PA4/DAC1) ; also sheet 3
UREVANT: IC13.31(PA6/TIM13_CH1/TIM3_CH1) ; also sheet 3
UREVFLT: IC13.16(PC1/ETH_MDC) ; also sheet 3
UREVIN: IC13.17(PC2/OTG_HS_ULPI_STP) ; also sheet 3
UTEMP: IC13.32(PA7/TIM14_CH1/TIM3_CH2) ; also sheet 3
UTEMP2: IC13.18(PC3/OTG_HS_ULPI_NXT) ; also sheet 3
VCC [Supply]: C54.1 C61.2 C66.2 C67.2 C68.2 C69.2 C70.2 C71.2 C72.2 C75.1 C76.1 C77.1 C78.1 C79.1 C80.1 DSP1.3(3V3) IC12.16(VCC) IC13.6(VBAT) IC13.11(VDD5) IC13.19(VDD12) IC13.28(VDD4) IC13.50(VDD1) IC13.75(VDD2) IC13.100(VDD3) LED1.1(A2) OSC1.1(E/D) OSC1.4(VCC) R95.1 R97.2 R98.2 R99.2 R101.1 ST3.1 ST4.1 ; also sheet 1,2,5
VCCIO [Supply]: C60.1 IC11.1(K2) ; supply symbol labelled  ; also sheet 1,3
VREF2: C62.1 C63.2 IC11.2(K1) IC13.21(VREF+) ; also sheet 3
WIFI_RXD: IC13.25(PA2/USART2_TX) ; also sheet 5
WIFI_TXD: IC13.26(PA3/USART2_RX) ; also sheet 5
Unconnected: DSP1.5 DSP1.24 DSP1.28(T_IRQ) DSP1.31(F_CS) DSP1.38 DSP1.39 DSP1.40 IC12.7(T2OUT) IC12.9(R2OUT) IC13.13(PH1/OSC_OUT) IC13.24(PA1/TIM5_CH1/TIM2_CH3) LED1.2(CBLUE)

### Buses
FSMC[0..15]
FSMC_CTRL[0..5]
GPIOC[0..15]
GPIOE[0..6]
GPIOD[2..13]
GPIOB[4..15]

### Notes on the sheet
- Voltage
  Reference
- Power AMP Controller
  7" Version 2
  DJ0ABR
  u-Controller
- BOOTLOAD
- Program
  Flash
- JTDO
- RST
- JTMS
- GND
- JTCK
- Vcc
- STM32F427VGT6
- TxD
- RxD
- Icom CI-V

## Sheet 5 of 5: WLAN IF
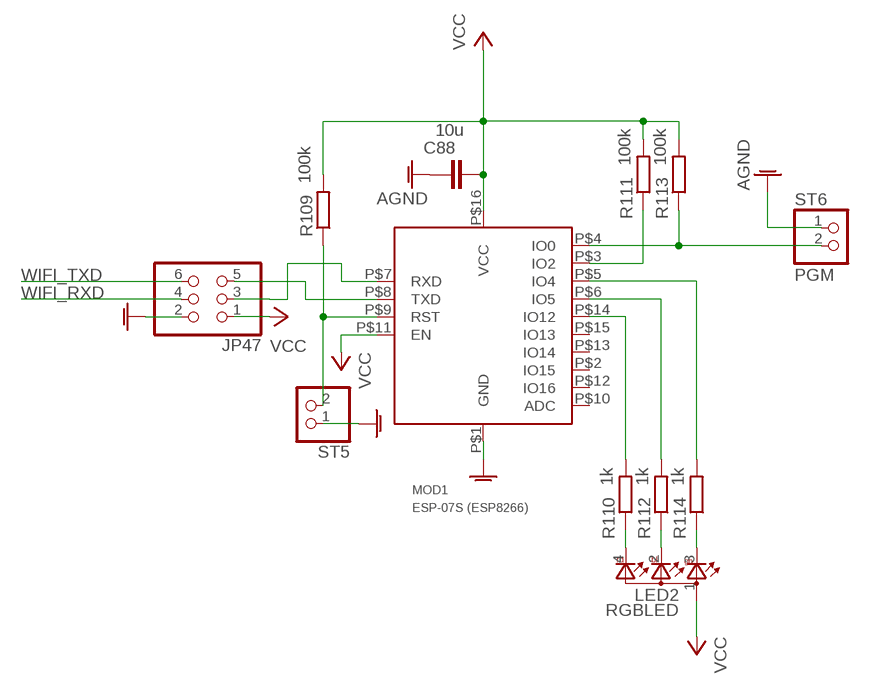
[diagram p4: schematic, sheet 5]

### Parts
C88  10u  C-EUC0805K  [C0805K]
JP47  PINHD-2X3  [2X03]
LED2  RGBLED  LED_RGB_WE  [PLCC4_WE_LED]
MOD1  ESP-07S (ESP8266)  ESP8266-1212  [ESP8266-12]
R109  100k  R-EU_R0603  [R0603]
R110  1k  R-EU_R0603  [R0603]
R111  100k  R-EU_R0603  [R0603]
R112  1k  R-EU_R0603  [R0603]
R113  100k  R-EU_R0603  [R0603]
R114  1k  R-EU_R0603  [R0603]
ST5  PINHEAD2X1BIG  [PINHEAD1X2BIG]
ST6  PGM  PINHEAD2X1SMALL  [PINHEAD1X2]

### Nets
AGND [AGND]: C88.1 JP47.2 MOD1.P$1(GND) ST5.1 ST6.1 ; supply symbol labelled  ; also sheet 1,2,3,4
N$16: MOD1.P$4(IO0) R113.1 ST6.2
N$17: LED2.3(CRED) R114.1
N$18: LED2.2(CBLUE) R112.1
N$20: LED2.4(CGREEN) R110.1
N$22: MOD1.P$14(IO12) R110.2
N$23: MOD1.P$6(IO5) R112.2
N$24: MOD1.P$9(RST) R109.1 ST5.2
N$25: MOD1.P$3(IO2) R111.1
N$26: MOD1.P$5(IO4) R114.2
N$101: JP47.3 MOD1.P$7(RXD)
N$102: JP47.5 MOD1.P$8(TXD)
VCC [Supply]: C88.2 JP47.1 LED2.1(A2) MOD1.P$11(EN) MOD1.P$16(VCC) R109.2 R111.2 R113.2 ; also sheet 1,2,4
WIFI_RXD: JP47.4 ; also sheet 4
WIFI_TXD: JP47.6 ; also sheet 4
Unconnected: MOD1.P$2(IO15) MOD1.P$10(ADC) MOD1.P$12(IO16) MOD1.P$13(IO14) MOD1.P$15(IO13)

## Library data of the parts
C1 = rcl:CPOL-EU: POLARIZED CAPACITOR, European symbol
C2-C119 = rcl:C-EU: CAPACITOR, European symbol
D1 D9-D13 = km:DIODE_GROSS
D2-D7 D14-D16 = diode:DIODE-: DIODE
DSP1 = km:DISPLAY7
FID1 FID2 = km:FIDUCIAL
IC1 = v-reg:LP2950?*: Source: http://cache.national.com/ds/LP/LP2950.pdf
IC2 = km:78XX
IC3 = km:UREG5
IC4 = burr-brown:INA168: High-Side Measurement Current Shunt Monitor; MF: TEXAS INSTRUMENTS; MPN: INA168NA/250; OC_FARNELL: 4375737; OC_NEWARK: 35C1744
IC5-IC9 = linear:LM358: OP AMP also LM158; LM258; LM2904 Source: http://cache.national.com/ds/LM/LM158.pdf
IC10 = linear:TL081: OP AMP
IC11 = km:LT1004
IC12 = maxim:MAX3232*: True RS-232 Transceivers 3.0V to 5.5V, Low-Power up to 1Mbps, Using Four 0.1µF External Capacitors Source: http://pdfserv.maxim-ic.com/en/ds/MAX3222-MAX3241.pdf; MPN: MAX3232CSE; OC_FARNELL: 9725490; OC_NEWARK: 90C2890
IC13 = STM32F205VG:STM32F205VG
JP1 JP2 JP26 JP27 JP38 = km:THICKPIN
JP4 JP47 = pinhead:PINHD-2X3: PIN HEADER
JP5 = pinhead:PINHD-2X7: PIN HEADER
JP6 = pinhead:PINHD-2X10: PIN HEADER
JP7 = pinhead:PINHD-2X4: PIN HEADER
JP8 = pinhead:PINHD-2X6: PIN HEADER
L1 = WE-PD3:WE-PD3: SMD-Shielded Power Inductor WE-PD3 - Magnetically shielded version which results in a low leakage field - High storage capacity - Low inherent-losses - Extremely low profile of type M: 2,7mm -- Is recommended for the application with switching regulators from National Semiconductor, Linear Technology, Texas Instruments and Fairchild Semiconductor -- EMI filter -- Perfectly suitable for switching regulators with extremely high efficiency; MPN: 74451147; OC_FARNELL: 1636065; OC_NEWARK: 08P2637; PACKAGE: Type S; SUPPLIER: Würth Elektronik eiSos GmbH
LED1 LED2 = km:LED_RGB_WE
MOD1 = km:ESP8266-12
OSC1 = km:QOSC_AUREL
Q1 = transistor-small-signal:BSS84: P-CHANNEL MOS FET
Q2 Q3 Q10 Q13-Q16 = km:BS170_: N-CHANNEL MOS FET
Q5-Q9 = transistor-power:IRF3704: SMPS MOSFET HEXFET® Power MOSFET Source: http://www.irf.com/product-info/datasheets/data/irf3704.pdf
R1-R25 R30-R35 R39-R41 R43 R45-R50 R53-R56 R58 R59 R62-R89 R91-R103 R109-R115 = rcl:R-EU_: RESISTOR, European symbol
R90 = km:MINIPOTI-S
ST3 = km:PINHEAD6X1
ST4-ST6 = km:PINHEAD2X1
U1 = km:TC7662AEPA: CONVERTER, DC-DC, HI VOLT

## Net classes
0 default: drill 0.3 mm
1 Supply: width 0.203 mm, drill 0.3 mm, clearance 0.178 mm
2 v12: drill 0.3 mm
3 v533: drill 0.3 mm
4 AGND: width 0.152 mm